# Altium schematic sheet Board-PowerSupply.SchDoc: =ProjectTitle
size 297 x 209 mm; Address1: Address1; Address2: Address2; Address3: Address3; Address4: Address4; SheetNumber: 4; SheetTotal: 6; Scale: 1:1; DocumentType: Схема электрическая принципиальная
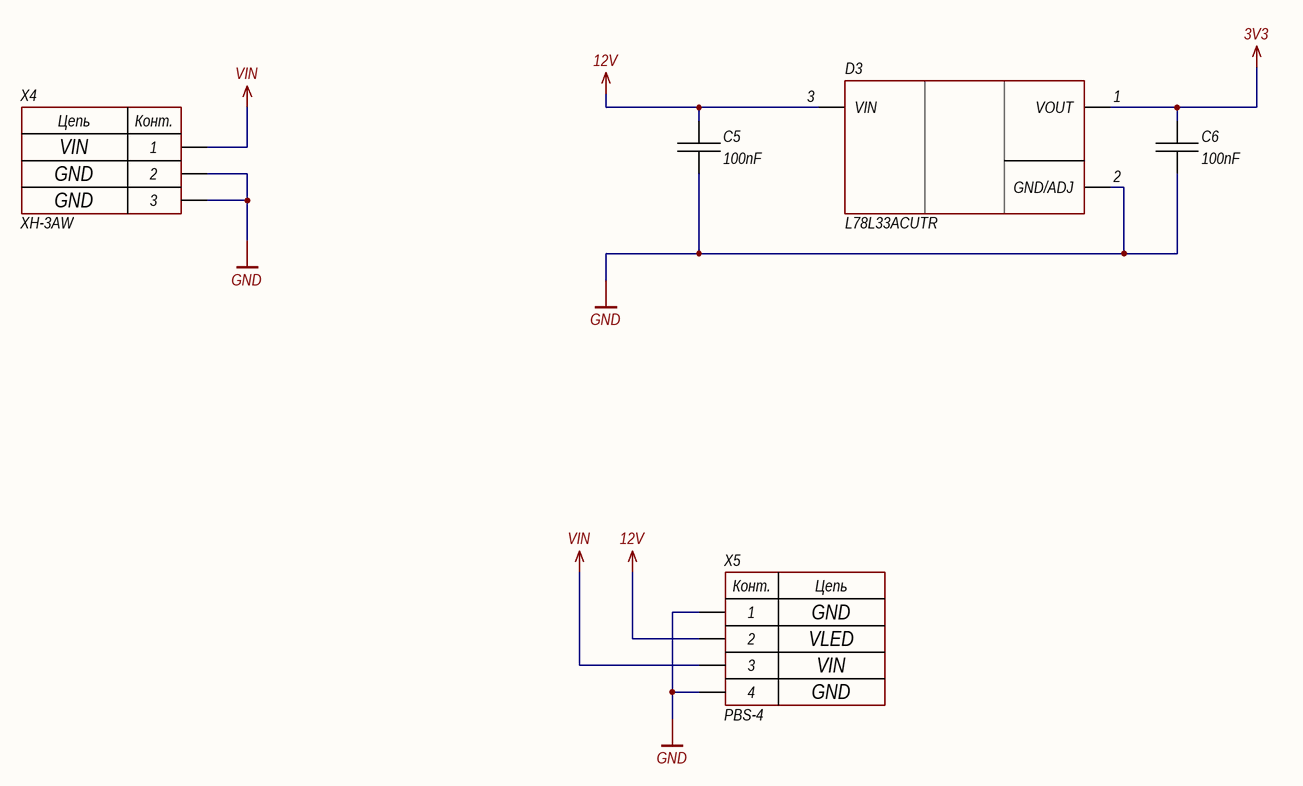
[diagram p0: Board-PowerSupply.SchDoc]

## Parts
C5  100nF  [CH0402C]
C6  100nF  [CH0402C]
D3  L78L33ACUTR  [SOT89_123]
X4  XH-3AW  [CON: XH-3AW]
X5  PBS-4  [CON: PBS-4]

## Nets
3V3: C6.2 D3.1(VOUT)
12V: C5.2 D3.3(VIN) X5.2
GND: C5.1 C6.1 D3.2(GND/ADJ) X4.2 X4.3 X5.1 X5.4
VIN: X4.1 X5.3

## Notes on the sheet
- VIN
- GND
- VLED
- Изм.
- Лист
- № докум.
- Подп.
- Дата
- Копировал
- Формат А4
- (in symbol 3-Connector) Цепь; Конт.
- (in symbol 4-Connector) Конт.; Цепь

## Library data of the parts
C5 C6 = Capacitor: Manufacturer: CCTC; Model: TCC0402X7R104K250AT; HelpURL: https://lcsc.com/product-detail/Multilayer-Ceramic-Capacitors-MLCC-SMD-SMT_CCTC-TCC0402X7R104K250AT_C466234.html; ComponentKind: X7R, 50V; Value: 100nF
D3 = L78LxxACUTR: Step-down; Manufacturer: ST Microelectronics; Model: L78L33ACUTR; HelpURL: https://www.st.com/resource/en/datasheet/l78l.pdf; ComponentKind: SOT-89, 100mA
X4 = 3-Connector: Model: XH-3AW; Manufacturer: *; HelpURL: *; ComponentKind: *
X5 = 4-Connector: Model: PBS-4; Manufacturer: *; HelpURL: *; ComponentKind: *; System: Connector